# EAGLE design auc-step-generator (EAGLE 9.4.1)
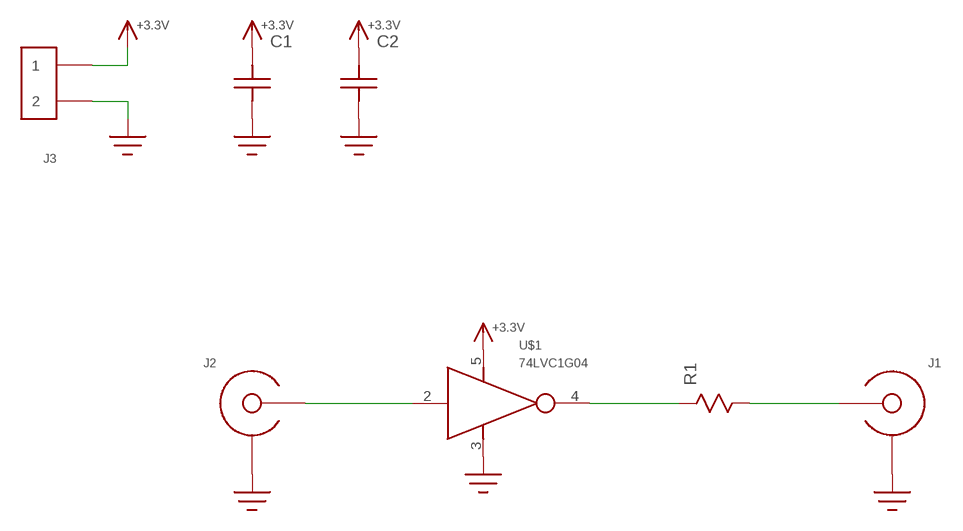
[diagram p0: schematic, sheet 1]

## Parts
C1  C1206  [1206]
C2  C0603  [C0603]
J1  SMA-EDGE-LAUNCH4020_TAPER  [SMA_EDGE_LAUNCH_2L_4020_TAPER]
J2  SMA-EDGE-LAUNCH4020_TAPER  [SMA_EDGE_LAUNCH_2L_4020_TAPER]
J3  HEADER_2PIN  [HEADER_2PIN]
R1  R0603  [R0603]
U$1  74LVC1G04  [SOT23-5]

## Nets
+3.3V: C1.P$2 C2.P$2 J3.1 U$1.5(VCC)
GND: C1.P$1 C2.P$1 J1.BOTTOM_GND(SHIELD) J1.GND@1(SHIELD) J1.GND@2(SHIELD) J1.GND@3(SHIELD) J1.GND@4(SHIELD) J1.GND@5(SHIELD) J1.GND@6(SHIELD) J1.GND@7(SHIELD) J1.GND@8(SHIELD) J1.GND@14(SHIELD) J1.GND@15(SHIELD) J1.GND@16(SHIELD) J1.GND@17(SHIELD) J1.GND_PAD1(SHIELD) J1.GND_PAD2(SHIELD) J1.P$1(SHIELD) J1.P$2(SHIELD) J2.BOTTOM_GND(SHIELD) J2.GND@1(SHIELD) J2.GND@2(SHIELD) J2.GND@3(SHIELD) J2.GND@4(SHIELD) J2.GND@5(SHIELD) J2.GND@6(SHIELD) J2.GND@7(SHIELD) J2.GND@8(SHIELD) J2.GND@14(SHIELD) J2.GND@15(SHIELD) J2.GND@16(SHIELD) J2.GND@17(SHIELD) J2.GND_PAD1(SHIELD) J2.GND_PAD2(SHIELD) J2.P$1(SHIELD) J2.P$2(SHIELD) J3.2 U$1.3(GND)
N$1 [29-6]: J2.CENTER@1(CENTER) U$1.2(IN)
N$2: R1.P$1 U$1.4(OUT)
N$3 [29-6]: J1.CENTER@1(CENTER) R1.P$2

## Library data of the parts
C1 C2 = yapo:C
J1 J2 = yapo:SMA-EDGE-LAUNCH
J3 = yapo:HEADER_2PIN
R1 = yapo:R
U$1 = yapo:74LVC1G04

## Net classes
1 29-6: width 0.737 mm, clearance 0.152 mm

## Board
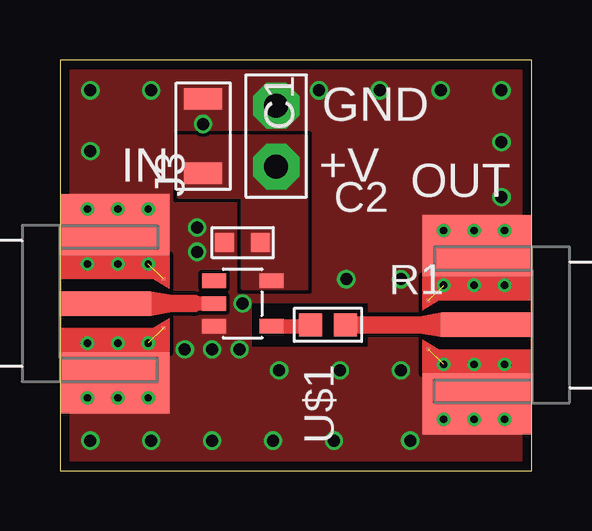
[diagram p1: board, top side]
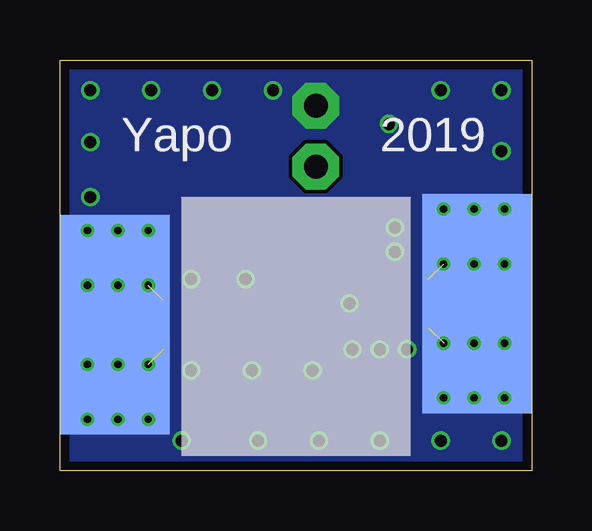
[diagram p2: board, bottom side, seen from below]

Size 19.68 x 17.14 mm. Coordinates in mm from the lower left corner, seen from the top.
Outline: 0,0 19.68,0 19.68,17.14 0,17.14 0,0
Copper layers (1*16): Top 0.035559375mm / dielectric 1.6mm / Bottom 0.035559375mm
Design rules "oshpark-2layer *": minimum track width 6mil, minimum drill 10mil, track to track 6mil, track to pad 6mil, pad to pad 6mil, via to via 6mil, smd to smd 6mil, copper to edge 15mil, drill to drill 6mil, minimum pad ring 5mil, minimum via ring 5mil, stop-mask expansion 2.5mil, vias tented up to drill 20mil, thermal gap 10mil

### Footprints (pad centres in the part's own frame; a part is rotated, then mirrored left to right if it is on the bottom)
1206 = smd 0.9 x 1.6: P$1 -1.55,0; P$2 1.55,0
C0603 = smd 0.8 x 0.8: P$1 -0.75,0; P$2 0.75,0
SMA_EDGE_LAUNCH_2L_4020_TAPER = smd 4.572 x 9.144 bottom: BOTTOM_GND 2.286,0 | smd 3.81 x 1.016: CENTER@1 1.905,0 | drill 0.3: GND@1 1.143,3.937; GND@2 3.683,3.937; GND@3 1.143,1.651; GND@4 3.683,1.651; GND@5 1.143,-1.651; GND@6 3.683,-1.651; GND@7 1.143,-3.937; GND@8 3.683,-3.937; GND@14 2.413,3.937; GND@15 2.413,-3.937; GND@16 2.413,-1.651; GND@17 2.413,1.651 | smd 4.572 x 2.54: GND_PAD1 2.286,3.302; GND_PAD2 2.286,-3.302 | smd 0.127 x 0.127: P$1 4.318,1.016; P$2 4.318,-1.016
HEADER_2PIN = drill 1 pad 1.93 octagon: 1 -1.27,0; 2 1.27,0
R0603 = smd 0.95 x 0.95: P$1 -0.725,0; P$2 0.725,0
SOT23-5 = smd 0.6 x 1: 1 -0.95,-1.2; 2 0,-1.2; 3 0.95,-1.2; 4 0.95,1.2; 5 -0.95,1.2

### Placement (x,y rotation side)
C1  5.97,13.97 270 top
C2  7.62,9.53 0 top
J1  19.68,6.1 180 top
J2  0,6.99 0 top
J3  9.02,13.97 90 top
R1  11.18,6.1 0 top
U$1  7.62,6.99 270 top

### Tracks (layer width: path | path; a pad name or v marks a point on that pad's centre or on a via)
+3.3V
  pour Top (no thermals): 7.62,7.62 10.29,7.62 10.29,13.97 4.95,13.97 4.95,11.43 7.62,11.43
GND  (via drill 0.5)  (4 unrouted)
  other vias: 6.35,5.08 5.71,9.14 5.71,10.16 7.62,6.99 7.49,5.08 5.21,5.08 1.27,15.88 1.27,1.27 18.41,15.88 15.88,15.88 13.34,15.88 1.27,13.34 3.81,15.88 5.97,14.48 3.81,1.27 6.35,1.27 8.89,1.27 11.43,1.27 14.61,1.27 18.41,13.72 18.41,11.43 14.22,8 14.22,4.19 11.68,4.19 9.14,4.19 11.94,8 10.79,15.88
  pour Top (rank 2, no thermals): 0,0 19.68,0 19.68,17.14 0,17.14
  pour Bottom (rank 2, no thermals): 0,0 19.68,0 19.68,17.14 0,17.14
  cutout Top (rank 2, no thermals): 8,6.99 12.83,6.99 12.83,5.21 8,5.21
N$1
  Top 0.61: U$1.2 5.59,6.99
  Top 0.737: 5.59,6.99 J2.CENTER@1
N$2
  Top 0.61: U$1.4 10.39,6.04 R1.P$1
N$3
  Top 0.737: J1.CENTER@1 R1.P$2

### Text on the board
tPlace: GND | IN | +V | OUT
bPlace: 2019 | Yapo